# EAGLE design jnusb_v30 (EAGLE 5.11)

## Sheet 1 of 2
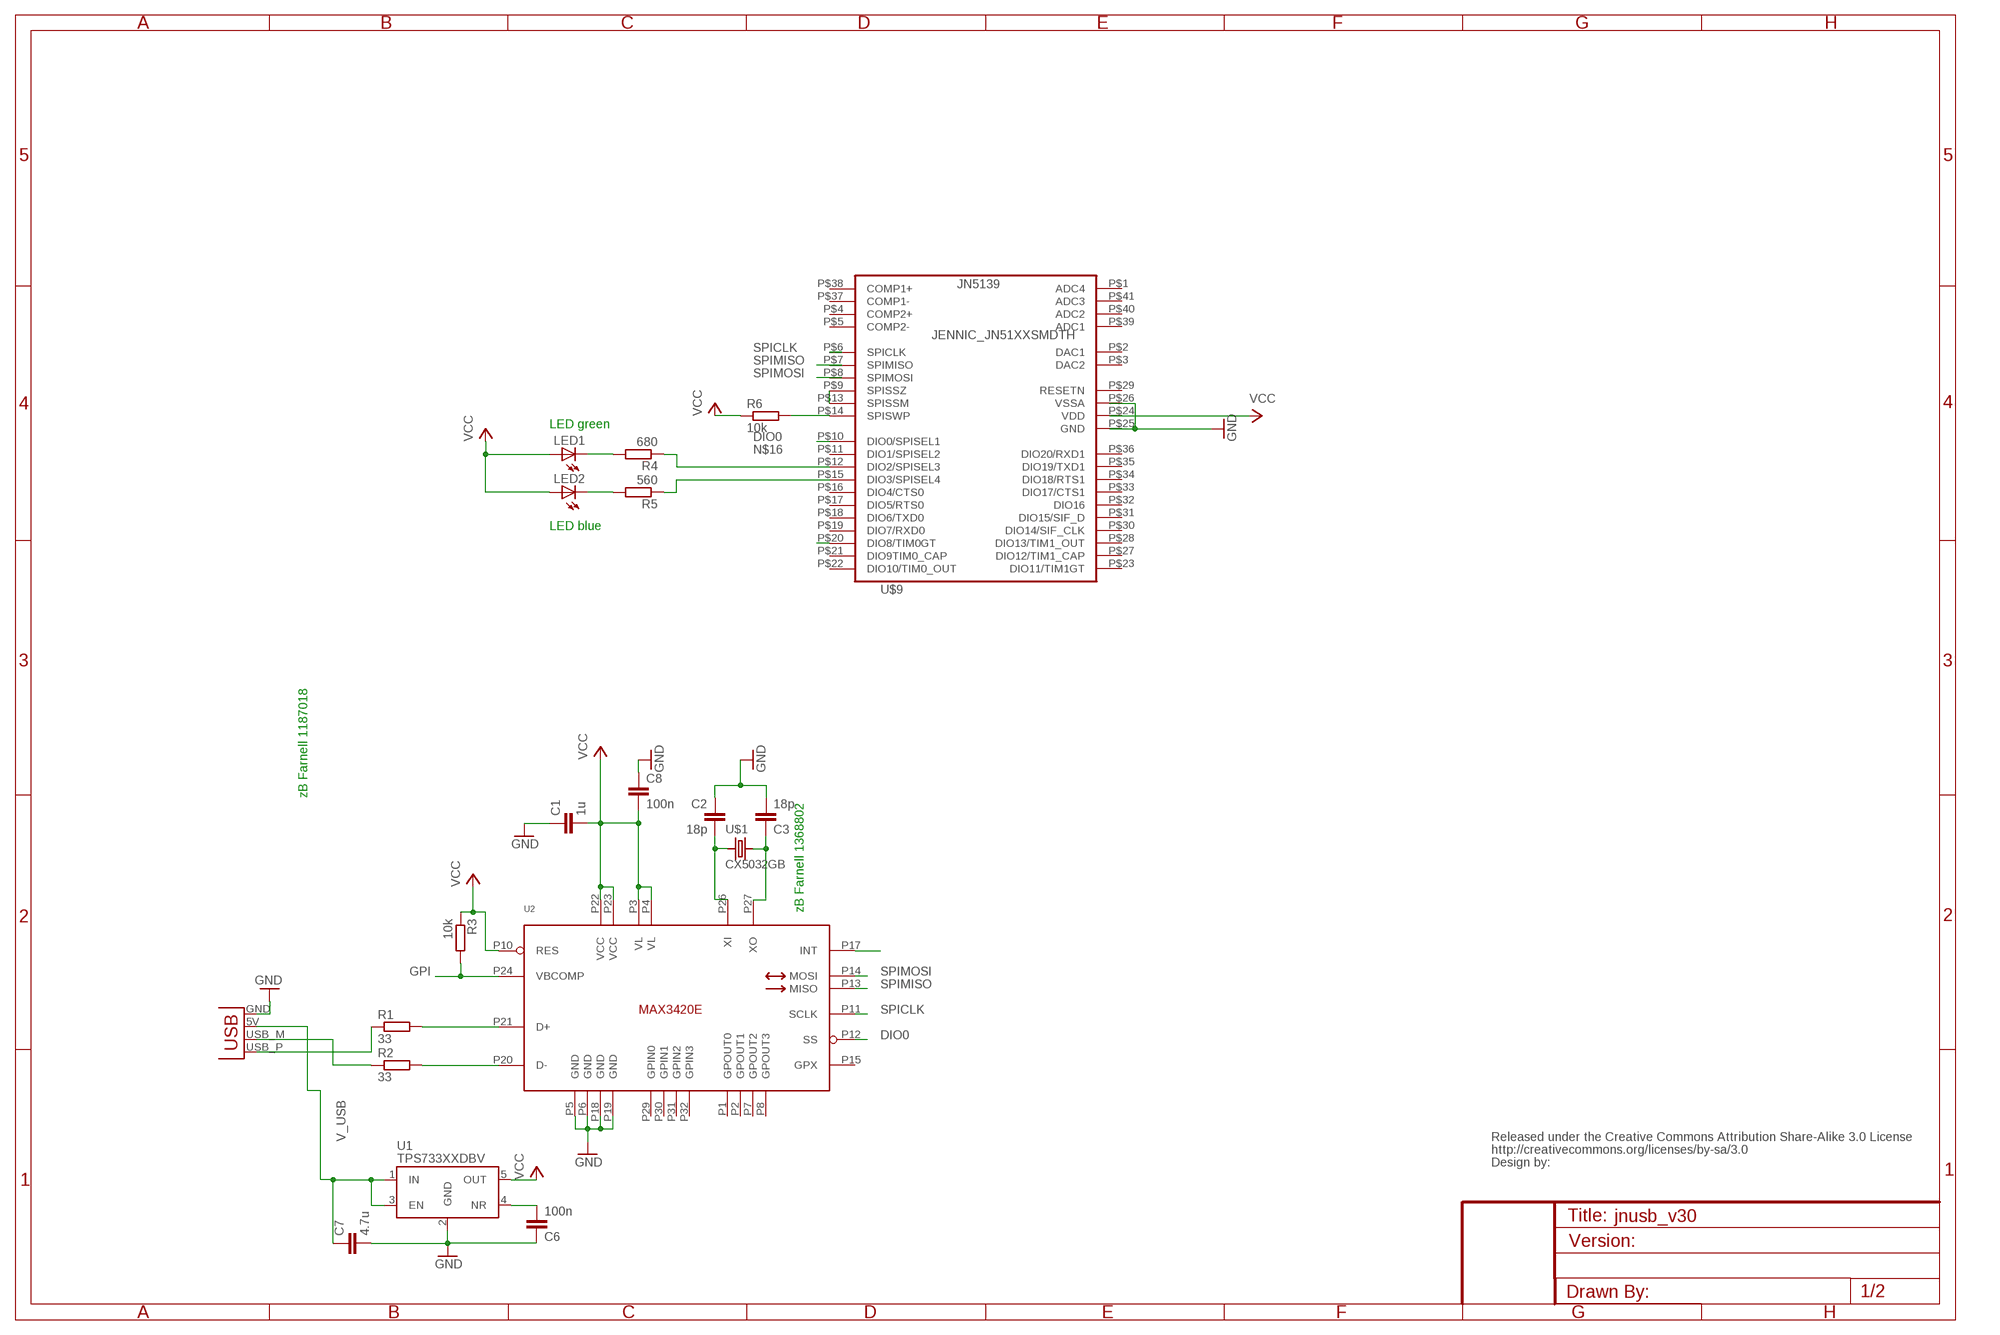
[diagram p0: schematic, sheet 1]

### Parts
C1  1u  C-EUC0603K  [C0603K]
C2  18p  C-EUC0603K  [C0603K]
C3  18p  C-EUC0603K  [C0603K]
C6  100n  C-EUC0603K  [C0603K]
C7  4.7u  C-EUC0402  [C0402]
C8  100n  C-EUC0603K  [C0603K]
LED1  LEDCHIP-LED0603  [CHIP-LED0603]
LED2  LEDCHIP-LED0603  [CHIP-LED0603]
R1  33  R-EU_R0603  [R0603]
R2  33  R-EU_R0603  [R0603]
R3  10k  R-EU_R0603  [R0603]
R4  680  R-EU_R0603  [R0603]
R5  560  R-EU_R0603  [R0603]
R6  10k  R-EU_R0603  [R0603]
U1  TPS733XXDBV  [SOT23-5]
U2  MAX3420ELQFP32  [LQFP32]
U$1  CX5032GB  [CX-53F]
U$5  CREATIVE_COMMONS  [CREATIVE_COMMONS]
U$9  JENNIC_JN51XXSMDTH  [JN5148_SMDTH]
X1  USBPCB  [USB-A-PCB]

### Nets
DIO0: U2.P12(SS) U$9.P$10(DIO0/SPISEL1)
DIO8: U2.P17(INT) U$9.P$20(DIO8/TIM0GT)
GND: C1.1 C2.1 C3.2 C6.1 C7.2 C8.1 U1.2(GND) U2.P5(GND) U2.P6(GND) U2.P18(GND) U2.P19(GND) U$9.P$25(GND) U$9.P$26(VSSA) X1.GND
GPI: R3.2 U2.P24(VBCOMP)
N$1: R1.1 X1.USB_P(D+)
N$2: R2.1 X1.USB_M(D-)
N$3: R1.2 U2.P21(D+)
N$4: R2.2 U2.P20(D-)
N$5: LED1.C R4.2
N$6: C6.2 U1.4(NR)
N$7: LED2.C R5.2
N$8: C2.2 U2.P26(XI) U$1.P$2
N$9: U$9.P$9(SPISSZ) U$9.P$13(SPISSM)
N$10: C3.1 U2.P27(XO) U$1.P$1
N$12: R4.1 U$9.P$12(DIO2/SPISEL3)
N$14: R6.2 U$9.P$14(SPISWP)
N$16: R5.1 U$9.P$15(DIO3/SPISEL4)
SPICLK: U2.P11(SCLK) U$9.P$6(SPICLK)
SPIMISO: U2.P13(MISO) U$9.P$7(SPIMISO)
SPIMOSI: U2.P14(MOSI) U$9.P$8(SPIMOSI)
V_USB: C7.1 U1.1(IN) U1.3(EN) X1.5V(VBUS)
VCC: C1.2 C8.2 LED1.A LED2.A R3.1 R6.1 U1.5(OUT) U2.P3(VL) U2.P4(VL) U2.P10(RES) U2.P22(VCC) U2.P23(VCC) U$9.P$24(VDD)
Unconnected: U2.P1(GPOUT0) U2.P2(GPOUT1) U2.P7(GPOUT2) U2.P8(GPOUT3) U2.P15(GPX) U2.P29(GPIN0) U2.P30(GPIN1) U2.P31(GPIN2) U2.P32(GPIN3) U$9.P$1(ADC4) U$9.P$2(DAC1) U$9.P$3(DAC2) U$9.P$4(COMP2+) U$9.P$5(COMP2-) U$9.P$11(DIO1/SPISEL2) U$9.P$16(DIO4/CTS0) U$9.P$17(DIO5/RTS0) U$9.P$18(DIO6/TXD0) U$9.P$19(DIO7/RXD0) U$9.P$21(DIO9TIM0_CAP) U$9.P$22(DIO10/TIM0_OUT) U$9.P$23(DIO11/TIM1GT) U$9.P$27(DIO12/TIM1_CAP) U$9.P$28(DIO13/TIM1_OUT) U$9.P$29(RESETN) U$9.P$30(DIO14/SIF_CLK) U$9.P$31(DIO15/SIF_D) U$9.P$32(DIO16) U$9.P$33(DIO17/CTS1) U$9.P$34(DIO18/RTS1) U$9.P$35(DIO19/TXD1) U$9.P$36(DIO20/RXD1) U$9.P$37(COMP1-) U$9.P$38(COMP1+) U$9.P$39(ADC1) U$9.P$40(ADC2) U$9.P$41(ADC3)

### Notes on the sheet
- LED green
- LED blue
- zB Farnell 1187018
- zB Farnell 1368802

## Sheet 2 of 2

## Library data of the parts
C1-C3 C6 C8 = rcl:C-EU: CAPACITOR, European symbol
C7 = resistor:C-EU: CAPACITOR, European symbol
LED1 LED2 = led:LED: LED OSRAM: - CHIPLED LG R971, LG N971, LY N971, LG Q971, LY Q971, LO R971, LY R971 LH N974, LH R974 LS Q976, LO Q976, LY Q976 LO Q996 - Hyper CHIPLED LW Q18S LB Q993, LB Q99A, LB R99A - SideLED LS A670, LO A670, LY A670, LG A670, LP A670 LB A673, LV A673, LT A673, LW A673 LH A674 LY A675 LS A676, LA A676, LO A676, LY A676, LW A676 LS A679, LY A679, LG A679 - Hyper Micro SIDELED® LS Y876, LA Y876, LO Y876, LY Y876 LT Y87S - SmartLED LW L88C, LW L88S LB L89C, LB L89S, LG L890 LS L89K, LO L89K, LY L89K LS L896, LA L896, LO L896, LY L896 - TOPLED LS T670, LO T670, LY T670, LG T670, LP T670 LSG T670, LSP T670, LSY T670, LOP T670, LYG T670 LG T671, LOG T671, LSG T671 LB T673, LV T673, LT T673, LW T673 LH T674 LS T676, LA T676, LO T676, LY T676, LB T676, LH T676, LSB T676, LW T676 LB T67C, LV T67C, LT T67C, LS T67K, LO T67K, LY T67K, LW E67C LS E67B, LA E67B, LO E67B, LY E67B, LB E67C, LV E67C, LT E67C LW T67C LS T679, LY T679, LG T679 LS T770, LO T770, LY T770, LG T770, LP T770 LB T773, LV T773, LT T773, LW T773 LH T774 LS E675, LA E675, LY E675, LS T675 LS T776, LA T776, LO T776, LY T776, LB T776 LHGB T686 LT T68C, LB T68C - Hyper Mini TOPLED® LB M676 - Mini TOPLED Santana® LG M470 LS M47K, LO M47K, LY M47K Source: http://www.osram.convergy.de/
R1-R6 = rcl:R-EU_: RESISTOR, European symbol
U1 = teco_ics:TPS733XX: ULTRALOW-NOISE, HIGH PSRR, FAST RF 200-mA LOW-DROPOUT LINEAR REGULATORS IN NANOSTAR WAFER CHIP SCALE AND SOT23 Farnell: 1207346
U2 = teco_ics:MAX3420E: MAXIM - MAX3420EECJ+ USB P/H CONTROLLER, SPI, 32LQFP Farnell Best.Nr.:1593354 USB P/H CONTROLLER, SPI, 32LQFP Treiber, IC-Typ:Controller Ausgänge, Zahl der:4 Spannung, Ausgang:4.3V Spannung, Versorgung min.:3V Gehäusetyp:LQFP Temperatur Arbeitsbereich:-40°C to +85°C Anschlussart:SMD Frequenz:26MHz Kanäle, Zahl der:4 Pin, Zahl der:32 Spannung, Versorgung max.:3.6V Temperatur, Betriebs- max.:85°C Temperatur, Betriebs- min.:-40°C
U$1 = teco_div:CX5032GB: Crystal CX-53F (CX5032GB) AVX - CX5032GB12000H0PESZZ - QUARZ, SM, CX-53F Farnell: 1368769 5 x 3.2mm SMD
U$5 = SparkFun:CREATIVE_COMMONS
U$9 = jnode:JENNIC_JN51XX: JN5139-xxx-M00xxx, Farnell: 1500175
X1 = SparkFun:USB: USB Connectors USB-B-PTH is fully proven SKU : PRT-00139 USB-miniB is fully proven SKU : PRT-00587 USB-A-PCB is untested. USB-A-H is throughly reviewed, but untested. Spark Fun Electronics SKU : PRT-00437 USB-B-SMT is throughly reviewed, but untested. Needs silkscreen touching up. USB-A-S has not been used/tested USB-MB-H has not been used/tested

## Board
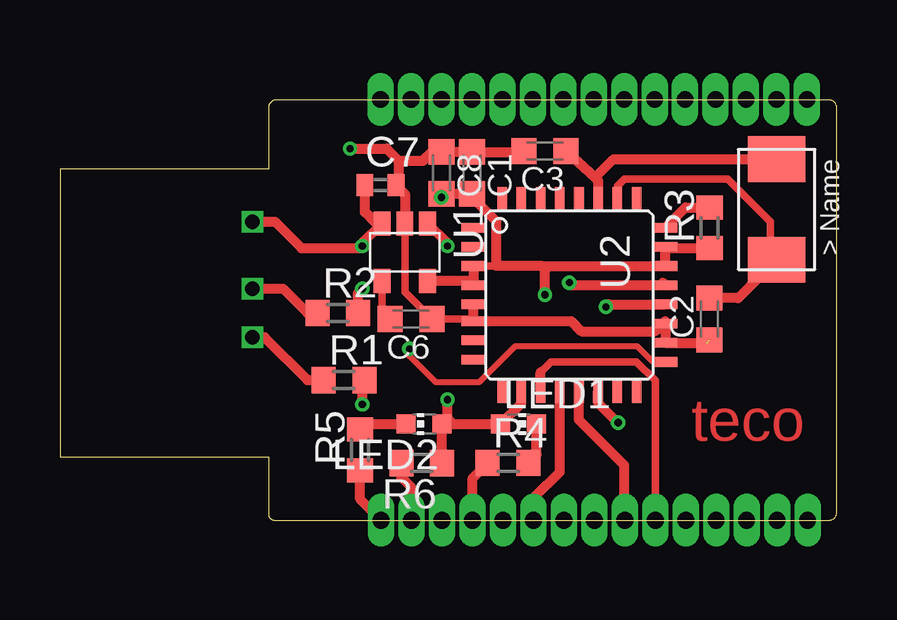
[diagram p1: board, top side]
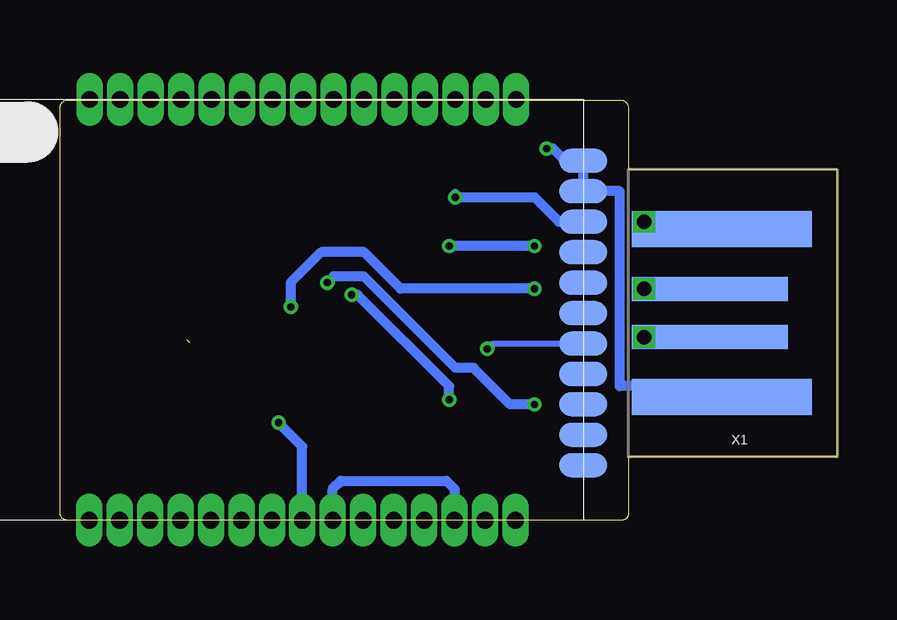
[diagram p2: board, bottom side, seen from below]

Size 32.38 x 17.52 mm. Coordinates in mm from the lower left corner, seen from the top.
Outline: 8.69,14.63 0,14.63 0,2.64 8.69,2.64 8.69,0.25 arc90 8.94,0 32.06,0 arc90 32.38,0.32 32.38,17.2 arc90 32.06,17.52 9.01,17.52 arc90 8.69,17.2 8.69,14.63
Copper layers (1*16): Top 0.035mm / dielectric 1.5mm / Bottom 0.035mm
Design rules "PCB-POOL Standard": minimum track width 0.15mm, minimum drill 0.3mm, track to track 0.15mm, track to pad 0.15mm, pad to pad 0.15mm, via to via 0.15mm, smd to smd 0.15mm, copper to edge 0.3mm, drill to drill 0.2mm, minimum pad ring 0.2mm, minimum via ring 0.15mm, stop-mask expansion 0.075mm, vias tented up to drill 0mil, thermal gap 0.2mm

### Footprints (pad centres in the part's own frame; a part is rotated, then mirrored left to right if it is on the bottom)
C0603K = smd 1.05 x 1.08: 1 -0.875,0; 2 0.875,0
C0402 = smd 0.7 x 0.9: 1 -0.65,0; 2 0.65,0
CHIP-LED0603 = smd 0.8 x 0.8: A 0,-0.75; C 0,0.75
R0603 = smd 1 x 1.1: 1 -0.85,0; 2 0.85,0
SOT23-5 = smd 1 x 0.7: 1 -1.2,0.95; 2 -1.2,0; 3 -1.2,-0.95; 4 1.2,-0.95; 5 1.2,0.95
LQFP32 = smd 0.4 x 1: P1 -2.8,-4; P2 -2,-4; P3 -1.2,-4; P4 -0.4,-4; P5 0.4,-4; P6 1.1,-4; P7 1.9,-4; P8 2.7,-4; P17 2.8,4; P18 2,4; P19 1.2,4; P20 0.4,4; P21 -0.4,4; P22 -1.2,4; P23 -2,4; P24 -2.8,4 | smd 1 x 0.4: P9 4,-2.8; P10 4,-2; P11 4,-1.2; P12 4,-0.4; P13 4,0.4; P14 4,1.2; P15 4,2; P16 4,2.8; P25 -4,2.8; P26 -4,2; P27 -4,1.2; P28 -4,0.4; P29 -4,-0.4; P30 -4,-1.2; P31 -4,-2; P32 -4,-2.8
CX-53F = smd 1.9 x 2.4: P$1 -2.1,0; P$2 2.1,0
JN5148_SMDTH = drill 0.7 pad 1.016 long: P$1 -2.29,20.6; P$2 -2.29,19.33; P$3 -2.29,18.06; P$4 -2.29,16.79; P$5 -2.29,15.52; P$6 -2.29,14.25; P$7 -2.29,12.98; P$8 -2.29,11.71; P$9 -2.29,10.44; P$10 -2.29,9.17; P$11 -2.29,7.9; P$12 -2.29,6.63; P$13 -2.29,5.36; P$14 -2.29,4.09; P$15 -2.29,2.82; P$27 15.254,2.794; P$28 15.254,4.064; P$29 15.254,5.334; P$30 15.254,6.604; P$31 15.254,7.874; P$32 15.254,9.144; P$33 15.254,10.414; P$34 15.254,11.684; P$35 15.254,12.954; P$36 15.254,14.224; P$37 15.254,15.494; P$38 15.254,16.764; P$39 15.254,18.034; P$40 15.254,19.304; P$41 15.254,20.574 | smd 1 x 2: P$16 0,0; P$17 1.27,0; P$18 2.54,0; P$19 3.81,0; P$20 5.08,0; P$21 6.35,0; P$22 7.62,0; P$23 8.89,0; P$24 10.16,0; P$25 11.43,0; P$26 12.7,0
USB-A-PCB = smd 7.5 x 1.5: 5V -0.2,-3.5; GND -0.2,3.5 | smd 6.5 x 1: USB_M 0.3,-1; USB_P 0.3,1

### Placement (x,y rotation side)
C1  17.17,14.48 270 top
C2  27.08,8.38 90 top
C3  20.22,15.39 180 top
C6  14.63,8.38 180 top
C7  13.36,13.97 0 top
C8  15.9,14.48 270 top
LED1  19.12,4.01 270 top
LED2  15.18,4.01 90 top
R1  11.84,5.84 0 top
R2  11.58,8.64 0 top
R3  27.08,12.19 90 top
R4  18.68,2.39 0 top
R5  12.51,2.93 90 top
R6  15.08,2.38 180 top
U1  14.38,11.18 270 top
U2  21.24,9.4 270 top
U$1  29.87,12.95 270 top
U$5  -3.66,-7.37 0 top  (outside the outline)
U$9  10.57,2.29 90 bottom
X1  4.98,8.64 180 bottom

### Tracks (layer width: path | path; a pad name or v marks a point on that pad's centre or on a via)
DIO0
  Top 0.406: U$9.P$10 19.77,0.03 19.77,0.94 20.84,2.01 U2.P12
DIO8  (via drill 0.3)
  Top 0.254: U2.P17 24.72,6.6 24.07,7.24 18.97,7.24 17.47,5.74 15.67,5.74 14.57,6.84 v14.57,7.14
  Bottom 0.254: v14.57,7.14 14.35,7.37 U$9.P$20
GND  (via drill 0.3 pad 0.3)  (1 unrouted)
  Top 0.305: U2.P6 17.15,8.38 C6.1 14.38,9.51 U1.2
  Top 0.406: 26.96,7.4 U2.P18 U2.P19 | U2.P19 25.24,8.3 | U2.P5 U2.P6 21.32,8.3 21.74,7.87 24.79,7.87 U2.P19 | C7.2 14.12,14.08 14.12,14.99 | C7.2 arc-90 14.12,13.86 | 14.12,14.99 15.14,14.99 15.51,15.35 C8.1 arc-6 C1.1 19.34,15.35 C3.2 | U1.2 14.38,13.6 C7.2 | v12.09,15.49 13.62,15.49 14.12,14.99
  Bottom 0.406: X1.GND 5.23,5.59 9.04,5.59 9.04,13.72 U$9.P$25 U$9.P$26 11.33,14.99 11.84,15.49 v12.09,15.49
GPI
  Top 0.406: R3.2 26.08,13.04 U2.P24
N$1  (via drill 0.6)
  Top 0.406: R1.1 10.31,5.84 8.54,7.62 v8.03,7.62
  Bottom 0.406: X1.USB_P 5.3,7.62 v8.03,7.62
N$2  (via drill 0.6)
  Top 0.406: R2.1 10.31,8.64 9.3,9.65 v8.03,9.65
  Bottom 0.406: X1.USB_M 5.3,9.65 v8.03,9.65
N$3  (via drill 0.3 pad 0.3)
  Top 0.406: 25.13,9.91 U2.P21 21.34,9.8 v21.24,9.91 | R1.2 12.6,5.75 v12.6,4.83
  Bottom 0.406: v12.6,4.83 13.62,4.83 15.14,6.35 15.9,6.35 19.71,10.16 20.98,10.16 v21.24,9.91
N$4  (via drill 0.3 pad 0.3)
  Top 0.406: U2.P20 22.87,9 arc90 v22.76,8.89 | v12.6,9.65 12.43,9.49 R2.2
  Bottom 0.406: v22.76,8.89 22.76,9.91 21.49,11.18 19.71,11.18 18.19,9.65 v12.6,9.65
N$5
  Top 0.406: R4.2 19.87,2.72 LED1.C
N$6
  Top 0.305: C6.2 13.43,8.71 U1.4
N$7
  Top 0.406: R5.2 12.74,4.01 LED2.C
N$8
  Top 0.305: U2.P26 23.24,13.94 23.52,14.22 27.84,14.22 29.62,12.45 29.62,11.11
  Top 0.406: C2.2 28.27,9.26 U$1.P$2 29.62,11.11
N$9
  Bottom 0.406: U$9.P$9 21.01,1.31 20.67,1.64 16.27,1.64 15.93,1.3 U$9.P$13
N$10
  Top 0.406: C3.1 22.31,14.28 | 22.31,14.28 22.44,14.15 U2.P27 | U$1.P$1 23.08,15.05 22.31,14.28
N$12
  Top 0.406: U$9.P$12 17.2,1.75 R4.1
N$14
  Top 0.406: U$9.P$14 14.67,0.01 14.67,1.34 14.23,1.78 R6.2
N$16
  Top 0.406: U$9.P$15 12.51,0.87 R5.1
SPICLK
  Top 0.305: 20.04,6.17 20.47,6.6 24.03,6.6 24.82,5.82 U$9.P$6
  Top 0.406: U2.P11 20.04,6.17
SPIMISO
  Top 0.406: U$9.P$7 23.52,0.02 23.52,2.29 21.64,4.17 U2.P13
SPIMOSI  (via drill 0.3 pad 0.3)
  Top 0.406: U2.P14 22.44,4.9 v23.27,4.06
  Bottom 0.406: v23.27,4.06 22.28,3.07 U$9.P$8
V_USB  (via drill 0.3 pad 0.3, 0.6)
  Top 0.406: C7.1 12.71,12.84 13.17,12.38 U1.3 | U1.3 13.43,12.26 13.36,12.19 | U1.3 12.6,11.55 v12.6,11.43 12.51,11.34 10.07,11.34 8.97,12.45 v8.03,12.45 | v16.16,11.43 16.16,11.55 U1.1
  Bottom 0.406: X1.5V 5.09,12.45 v8.03,12.45 | v12.6,11.43 v16.16,11.43
VCC  (via drill 0.3 pad 0.3)
  Top 0.305: 18.19,10.6 U2.P3
  Top 0.406: 20.04,10.6 U2.P22 U2.P23 25.29,11.34 R3.1 | U1.5 17.06,9.98 U2.P4 U2.P3 | 20.04,10.6 18.19,10.6 18.19,12.45 17.17,13.46 C1.2 C8.2 v15.9,13.46 | 20.04,10.6 arc-90 20.22,10.41 v20.22,9.4 | 16.16,4.24 LED2.A R6.1 | 16.16,4.24 v16.16,5.03 | 16.16,4.24 16.38,4.01 LED1.A 19.24,4.88 U2.P10
  Bottom 0.406: v20.22,9.4 19.97,9.4 16.16,5.59 v16.16,5.03 | U$9.P$24 11.58,12.45 12.6,13.46 15.76,13.46 | 15.76,13.46 C8.2 | v15.9,13.46 15.76,13.46

### Text on the board
Top: teco